# EAGLE schematic Box Electronics v26 (EAGLE 9.7.0)

## Sheet 1 of 3
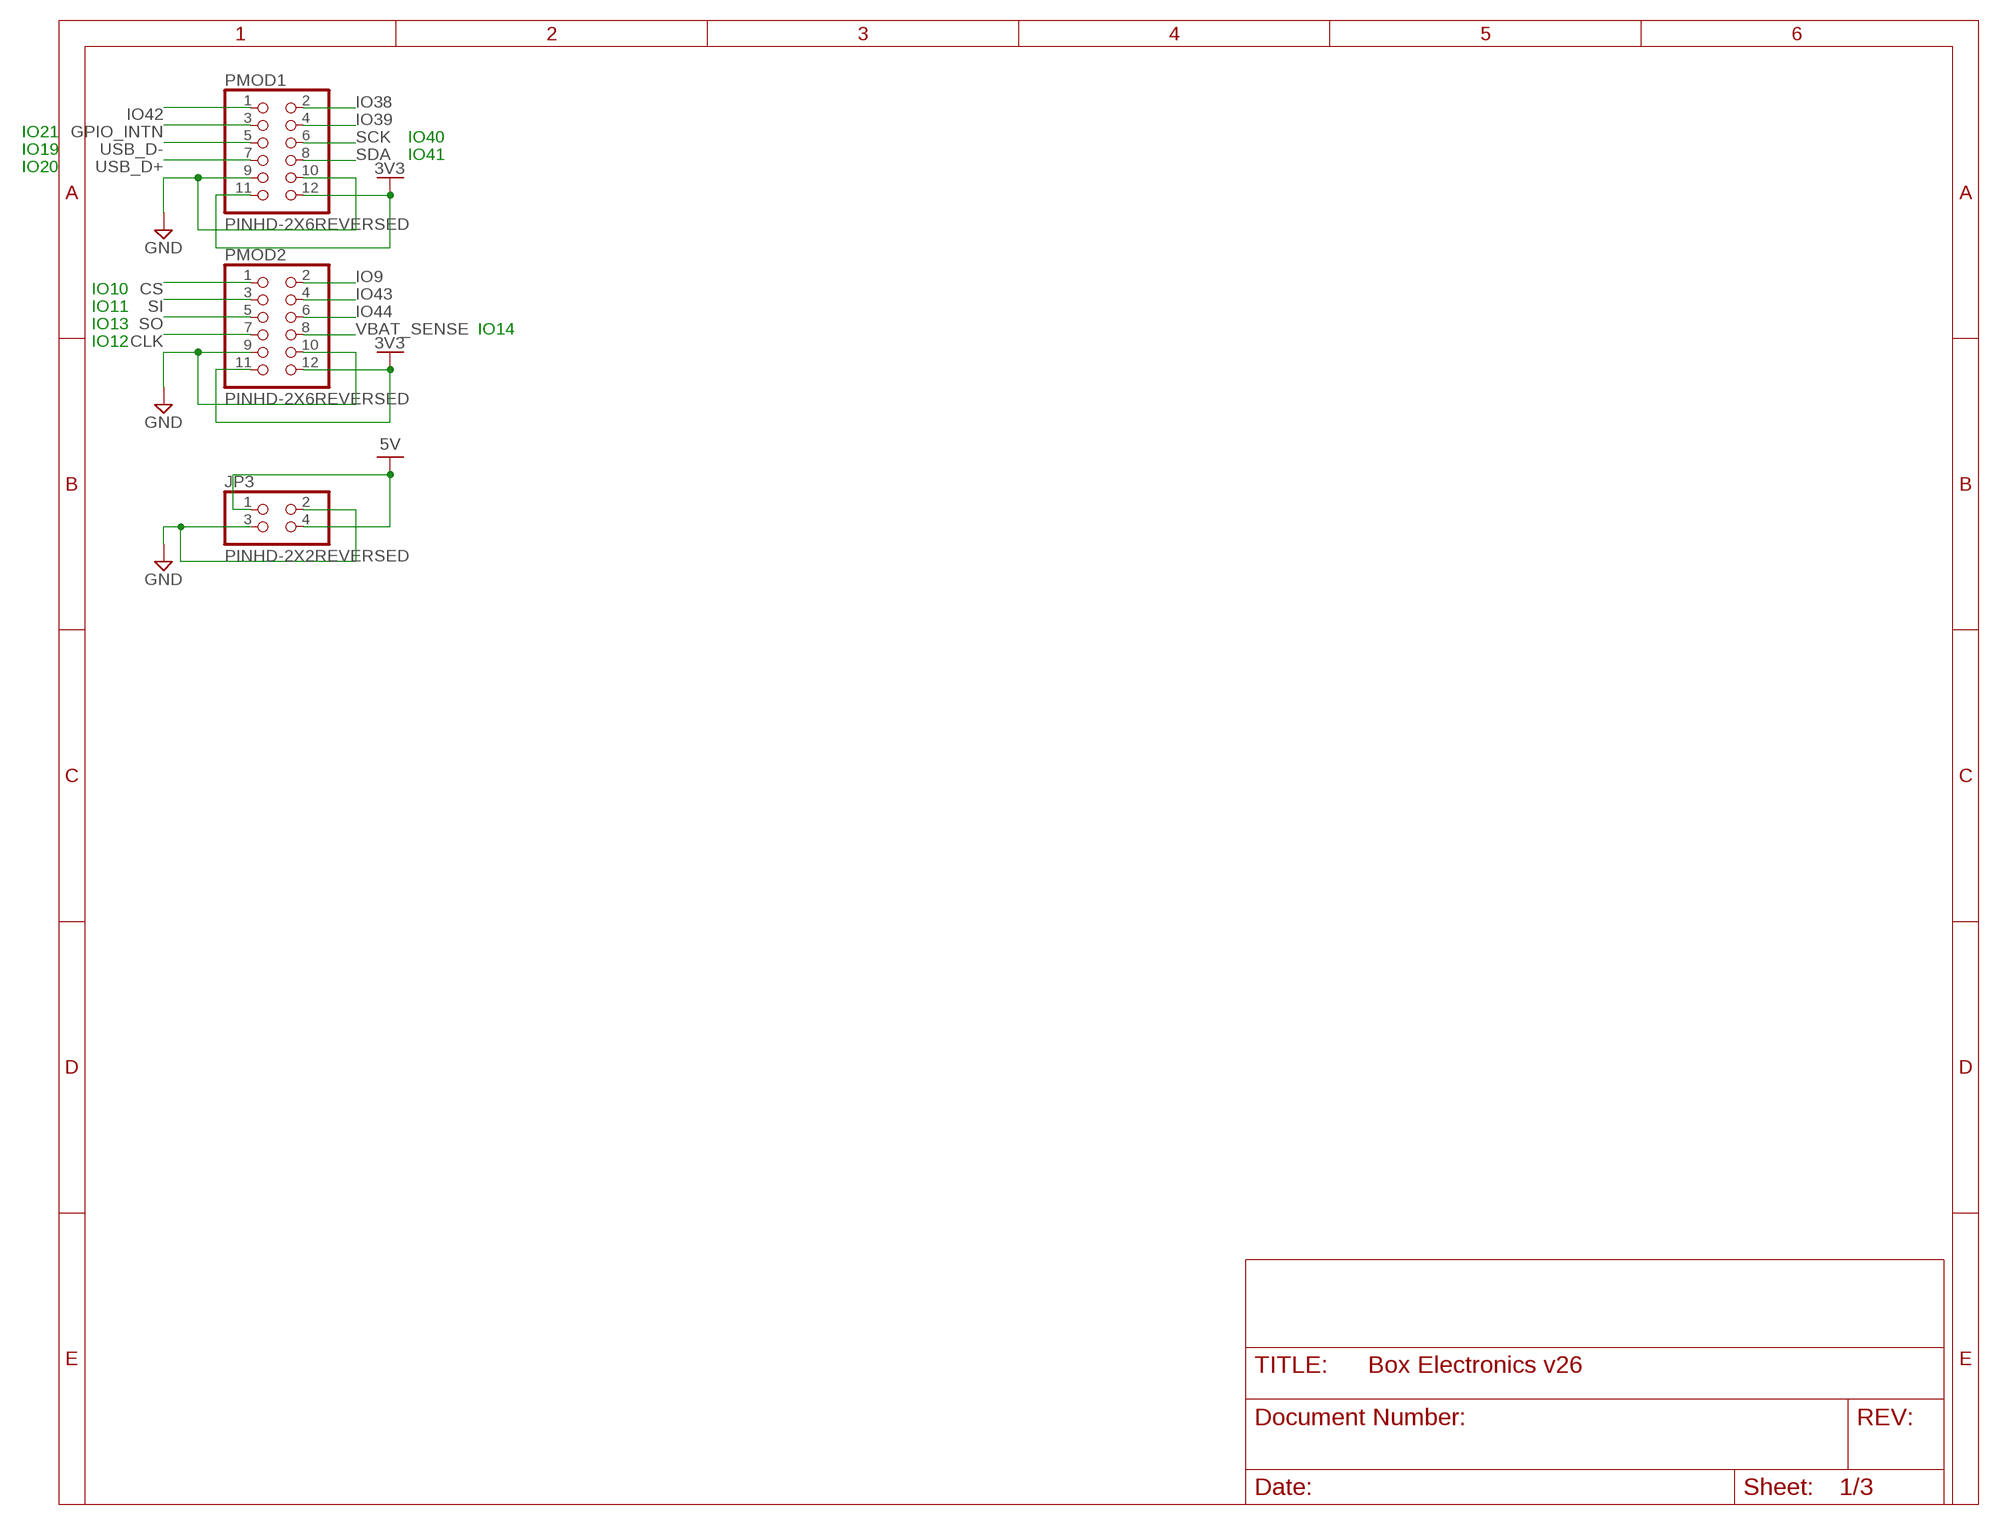
[diagram p0: schematic, sheet 1]

### Parts
JP3  PINHD-2X2REVERSED  [2X02/EDGE_REVERSED]
PMOD1  PINHD-2X6REVERSED  [2X06/EDGE_REVERSED]
PMOD2  PINHD-2X6REVERSED  [2X06/EDGE_REVERSED]

### Nets
3V3: PMOD1.11 PMOD1.12 PMOD2.11 PMOD2.12 ; also sheet 2,3
5V: JP3.1 JP3.4 ; also sheet 2
CLK: PMOD2.7 ; also sheet 2
CS: PMOD2.1 ; also sheet 2
GND: JP3.2 JP3.3 PMOD1.9 PMOD1.10 PMOD2.9 PMOD2.10 ; also sheet 2,3
GPIO_INTN: PMOD1.3 ; also sheet 2
IO9: PMOD2.2
IO38: PMOD1.2
IO39: PMOD1.4
IO42: PMOD1.1
IO43: PMOD2.4
IO44: PMOD2.6
SCK: PMOD1.6 ; also sheet 2
SDA: PMOD1.8 ; also sheet 2
SI: PMOD2.3 ; also sheet 2
SO: PMOD2.5 ; also sheet 2
USB_D+: PMOD1.7 ; also sheet 2
USB_D-: PMOD1.5 ; also sheet 2
VBAT_SENSE: PMOD2.8 ; also sheet 2

### Notes on the sheet
- IO21
- IO19 | IO40
- IO20 | IO41
- IO10
- IO11
- IO13
- IO12 | IO14

## Sheet 2 of 3
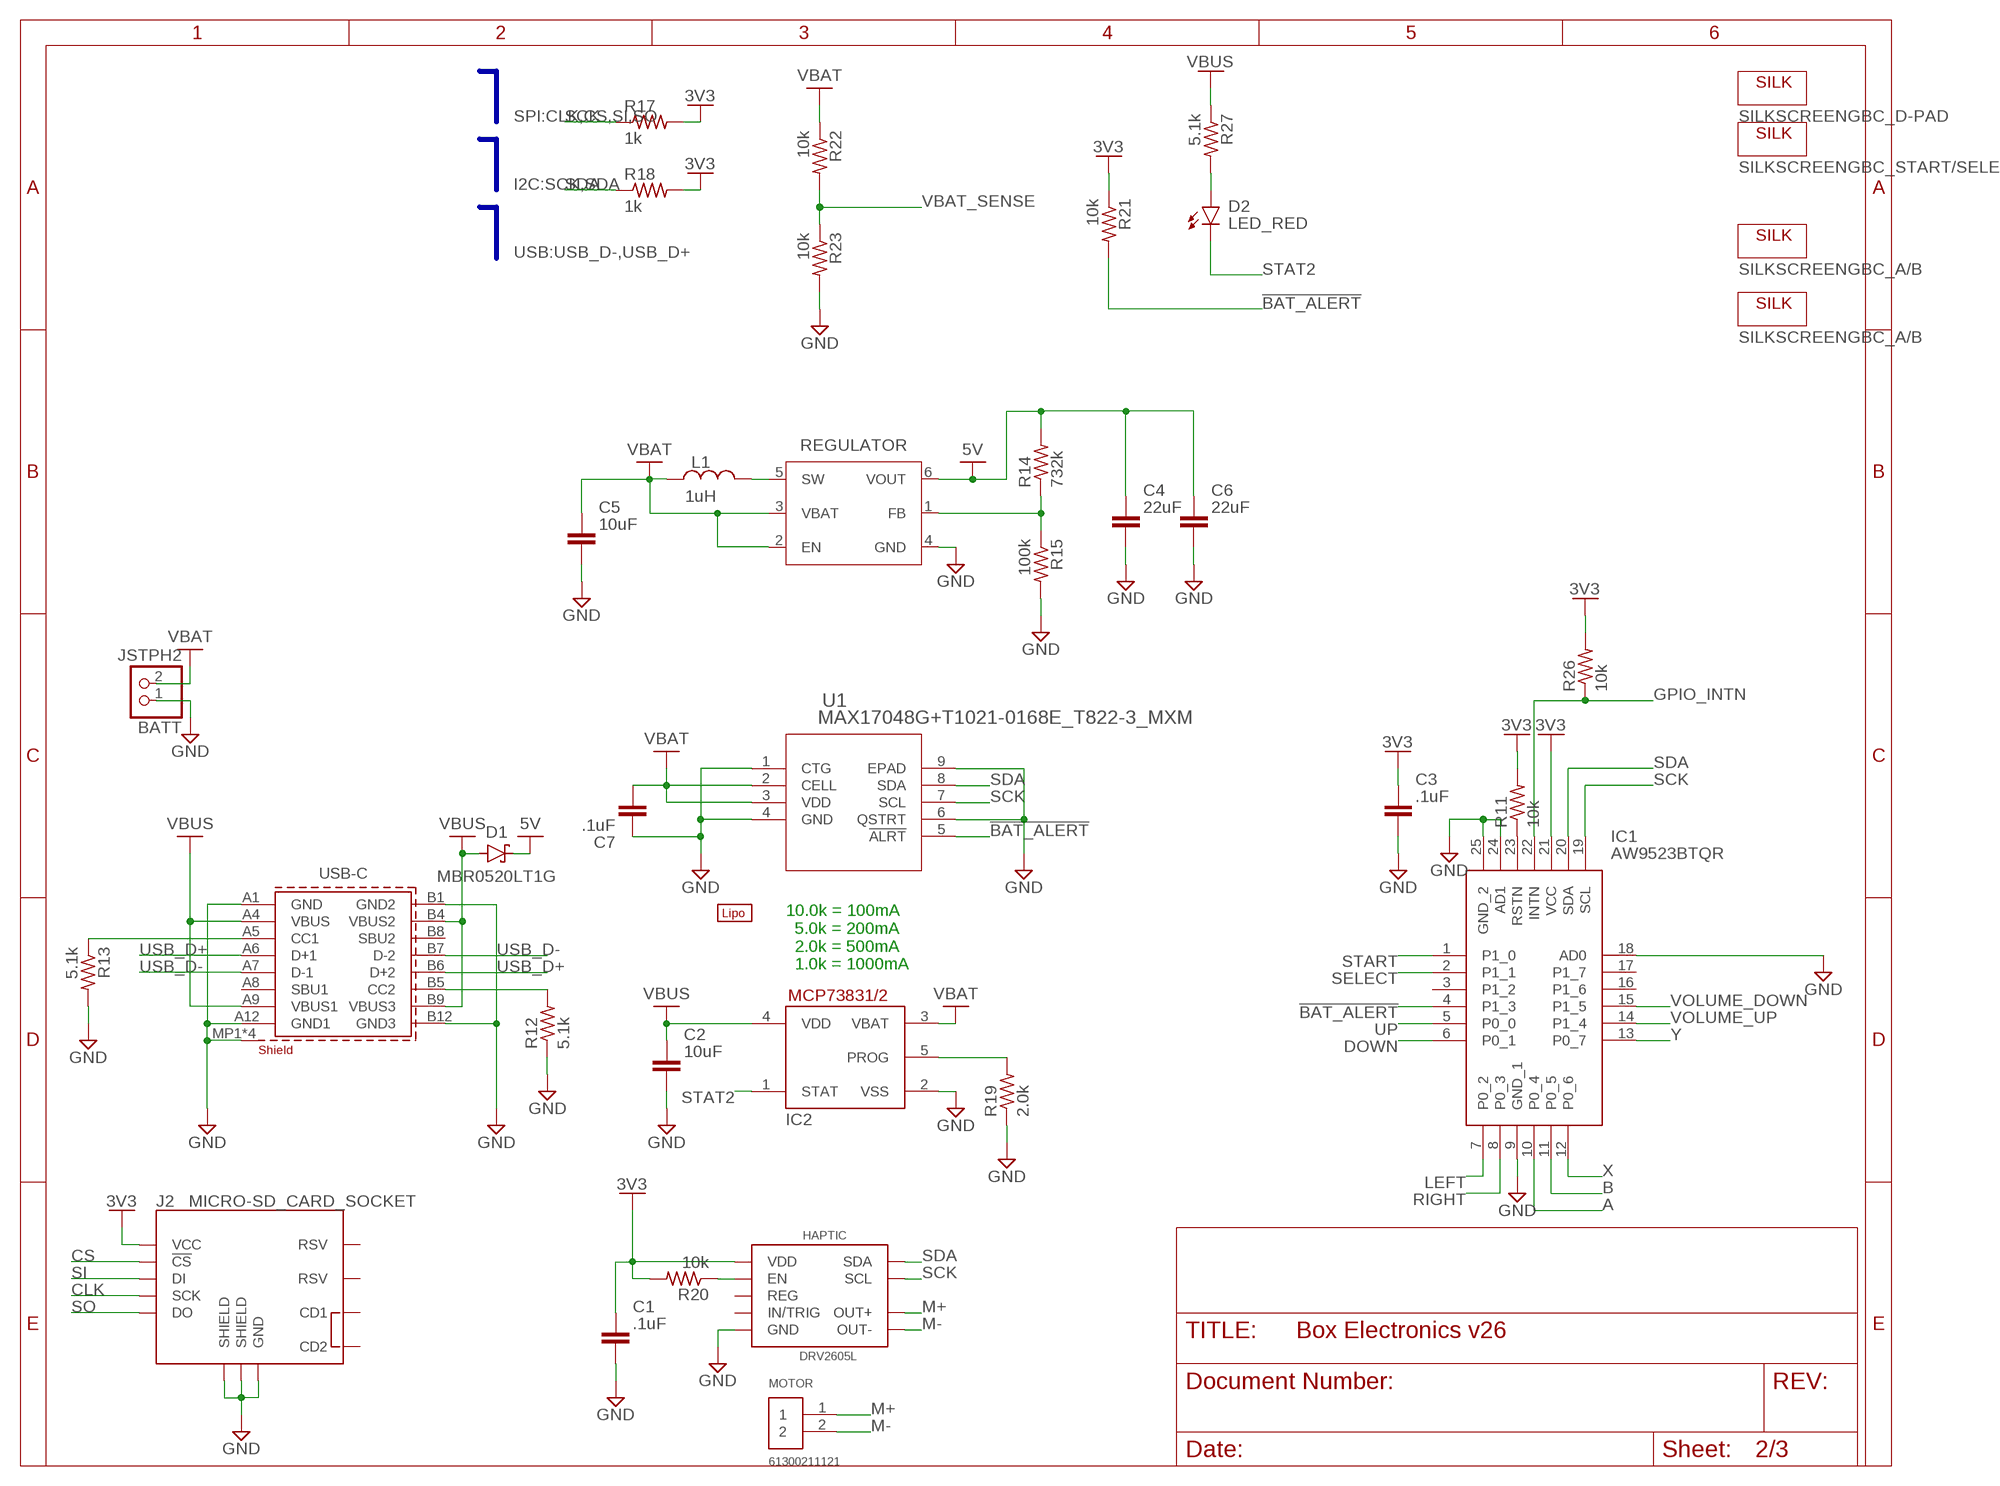
[diagram p1: schematic, sheet 2]

### Parts
BATT  JSTPH2  [JSTPH2]
BT1  LIPO-OUTLINE1100  [LIPO-1000]
C1  .1uF  C_CHIP-0603(1608-METRIC)  [CAPC1608X85]
C2  10uF  C_CHIP-0603(1608-METRIC)  [CAPC1608X85]
C3  .1uF  C_CHIP-0603(1608-METRIC)  [CAPC1608X85]
C4  22uF  C_CHIP-0805(2012-METRIC)  [CAPC2012X110]
C5  10uF  C_CHIP-0603(1608-METRIC)  [CAPC1608X85]
C6  22uF  C_CHIP-0805(2012-METRIC)  [CAPC2012X110]
C7  .1uF  C_CHIP-0603(1608-METRIC)  [CAPC1608X85]
D1  MBR0520LT1G  SCHOTTKY_MBR0520LT1GDO-219  [SODFL3718X115]
D2  LED_RED  CHIP-FLAT-R_0805  [LEDC2012X110N_FLAT-R]
HAPTIC  DRV2605L  [VSSOP-10]
IC1  AW9523BTQR  [QFN50P400X400X80-25N]
IC2  MCP73831/OT  [SOT23-5L]
J2  MICRO-SD_CARD_SOCKET  [MICRO-SD-SOCKET]
L1  1uH  L_CHIP-0805(2012-METRIC)  [INDC2009X120]
MOTOR  61300211121  [61300211121]
R11  10k  R-US_CHIP-0603(1608-METRIC)  [RESC1608X60]
R12  5.1k  R-US_CHIP-0603(1608-METRIC)  [RESC1608X60]
R13  5.1k  R-US_CHIP-0603(1608-METRIC)  [RESC1608X60]
R14  732k  R-US_CHIP-0603(1608-METRIC)  [RESC1608X60]
R15  100k  R-US_CHIP-0603(1608-METRIC)  [RESC1608X60]
R17  1k  R-US_CHIP-0603(1608-METRIC)  [RESC1608X60]
R18  1k  R-US_CHIP-0603(1608-METRIC)  [RESC1608X60]
R19  2.0k  R-US_CHIP-0603(1608-METRIC)  [RESC1608X60]
R20  10k  R-US_CHIP-0603(1608-METRIC)  [RESC1608X60]
R21  10k  R-US_CHIP-0603(1608-METRIC)  [RESC1608X60]
R22  10k  R-US_CHIP-0603(1608-METRIC)  [RESC1608X60]
R23  10k  R-US_CHIP-0603(1608-METRIC)  [RESC1608X60]
R26  10k  R-US_CHIP-0603(1608-METRIC)  [RESC1608X60]
R27  5.1k  R-US_CHIP-0603(1608-METRIC)  [RESC1608X60]
REGULATOR  TPS61070  TPS61023  [SOT563]
U1  MAX17048G+T1021-0168E_T822-3_MXM  [21-0168E_T822-3_MXM]
U$1  SILKSCREENGBC_D-PAD  [GAMEBOY_COLOR_DPAD_SILK]
U$2  SILKSCREENGBC_START/SELECT  [GAMEBOY_COLOR_START_SELECT_SILK]
U$3  SILKSCREENGBC_A/B  [GAMEBOY_COLOR_A/B_BUTTON_MEMBRANE]
U$4  SILKSCREENGBC_A/B  [GAMEBOY_COLOR_A/B_BUTTON_MEMBRANE]
USB-C  629722000214  629722000214SMD  [USB4110GFA]

### Nets
3V3: C1.1 C3.1 HAPTIC.6(VDD) HAPTIC.10(VDD) IC1.21(VCC) J2.VCC R11.2 R17.2 R18.2 R20.2 R21.1 R26.2 ; also sheet 1,3
5V: C4.1 C6.1 D1.1(C) R14.2 REGULATOR.6(VOUT) ; also sheet 1
!BAT_ALERT: IC1.4(P1_3) R21.2 U1.5(!ALRT)
A: IC1.10(P0_4) ; also sheet 3
B: IC1.11(P0_5) ; also sheet 3
CLK: J2.SCLK(SCK) ; also sheet 1
CS: J2.CS(!CS) ; also sheet 1
DOWN: IC1.6(P0_1) ; also sheet 3
GND: BATT.1 C1.2 C2.2 C3.2 C4.2 C5.2 C6.2 C7.1 HAPTIC.8(GND) IC1.9(GND_1) IC1.18(AD0) IC1.24(AD1) IC1.25(GND_2) IC2.2(VSS) J2.GND J2.GND1(SHIELD) J2.GND3(SHIELD) R12.1 R13.2 R15.2 R19.1 R23.2 REGULATOR.4(GND) U1.1(CTG) U1.4(GND) U1.6(QSTRT) U1.9(EPAD) USB-C.A1(GND) USB-C.A12(GND1) USB-C.B1(GND2) USB-C.B12(GND3) USB-C.MP1(SHIELD) USB-C.MP2(SHIELD) USB-C.MP3(SHIELD) USB-C.MP4(SHIELD) ; also sheet 1,3
GPIO_INTN: IC1.22(INTN) R26.1 ; also sheet 1
LEFT: IC1.7(P0_2) ; also sheet 3
M+: HAPTIC.7(OUT+) MOTOR.1
M-: HAPTIC.9(OUT-) MOTOR.2
N$77: R12.2 USB-C.B5(CC2)
N$78: R13.1 USB-C.A5(CC1)
N$79: R14.1 R15.1 REGULATOR.1(FB)
N$80: L1.2 REGULATOR.5(SW)
N$81: IC2.5(PROG) R19.2
N$82: HAPTIC.5(EN) R20.1
N$83: IC1.23(RSTN) R11.1
N$84: D2.A R27.2
RIGHT: IC1.8(P0_3) ; also sheet 3
SCK: HAPTIC.2(SCL) IC1.19(SCL) R17.1 U1.7(SCL) ; also sheet 1
SDA: HAPTIC.3(SDA) IC1.20(SDA) R18.1 U1.8(SDA) ; also sheet 1
SELECT: IC1.2(P1_1) ; also sheet 3
SI: J2.DI ; also sheet 1
SO: J2.DO ; also sheet 1
START: IC1.1(P1_0) ; also sheet 3
STAT2: D2.C IC2.1(STAT)
UP: IC1.5(P0_0) ; also sheet 3
USB_D+: USB-C.A6(D+1) USB-C.B6(D+2) ; also sheet 1
USB_D-: USB-C.A7(D-1) USB-C.B7(D-2) ; also sheet 1
VBAT: BATT.2 C5.1 C7.2 IC2.3(VBAT) L1.1 R22.1 REGULATOR.2(EN) REGULATOR.3(VBAT) U1.2(CELL) U1.3(VDD)
VBAT_SENSE: R22.2 R23.1 ; also sheet 1
VBUS: C2.1 D1.2(A) IC2.4(VDD) R27.1 USB-C.A4(VBUS) USB-C.A9(VBUS1) USB-C.B4(VBUS2) USB-C.B9(VBUS3)
VOLUME_DOWN: IC1.15(P1_5) ; also sheet 3
VOLUME_UP: IC1.14(P1_4) ; also sheet 3
X: IC1.12(P0_6) ; also sheet 3
Y: IC1.13(P0_7) ; also sheet 3
Unconnected: HAPTIC.1(REG) HAPTIC.4(IN/TRIG) IC1.3(P1_2) IC1.16(P1_6) IC1.17(P1_7) J2.CD1 J2.CD2 J2.RSV1(RSV) J2.RSV2(RSV) USB-C.A8(SBU1) USB-C.B8(SBU2)

### Buses
SPI:CLK,CS,SI,SO
I2C:SCK,SDA
USB:USB_D-,USB_D+

### Notes on the sheet
- 10.0k = 100mA
    5.0k = 200mA
    2.0k = 500mA
    1.0k = 1000mA

## Sheet 3 of 3
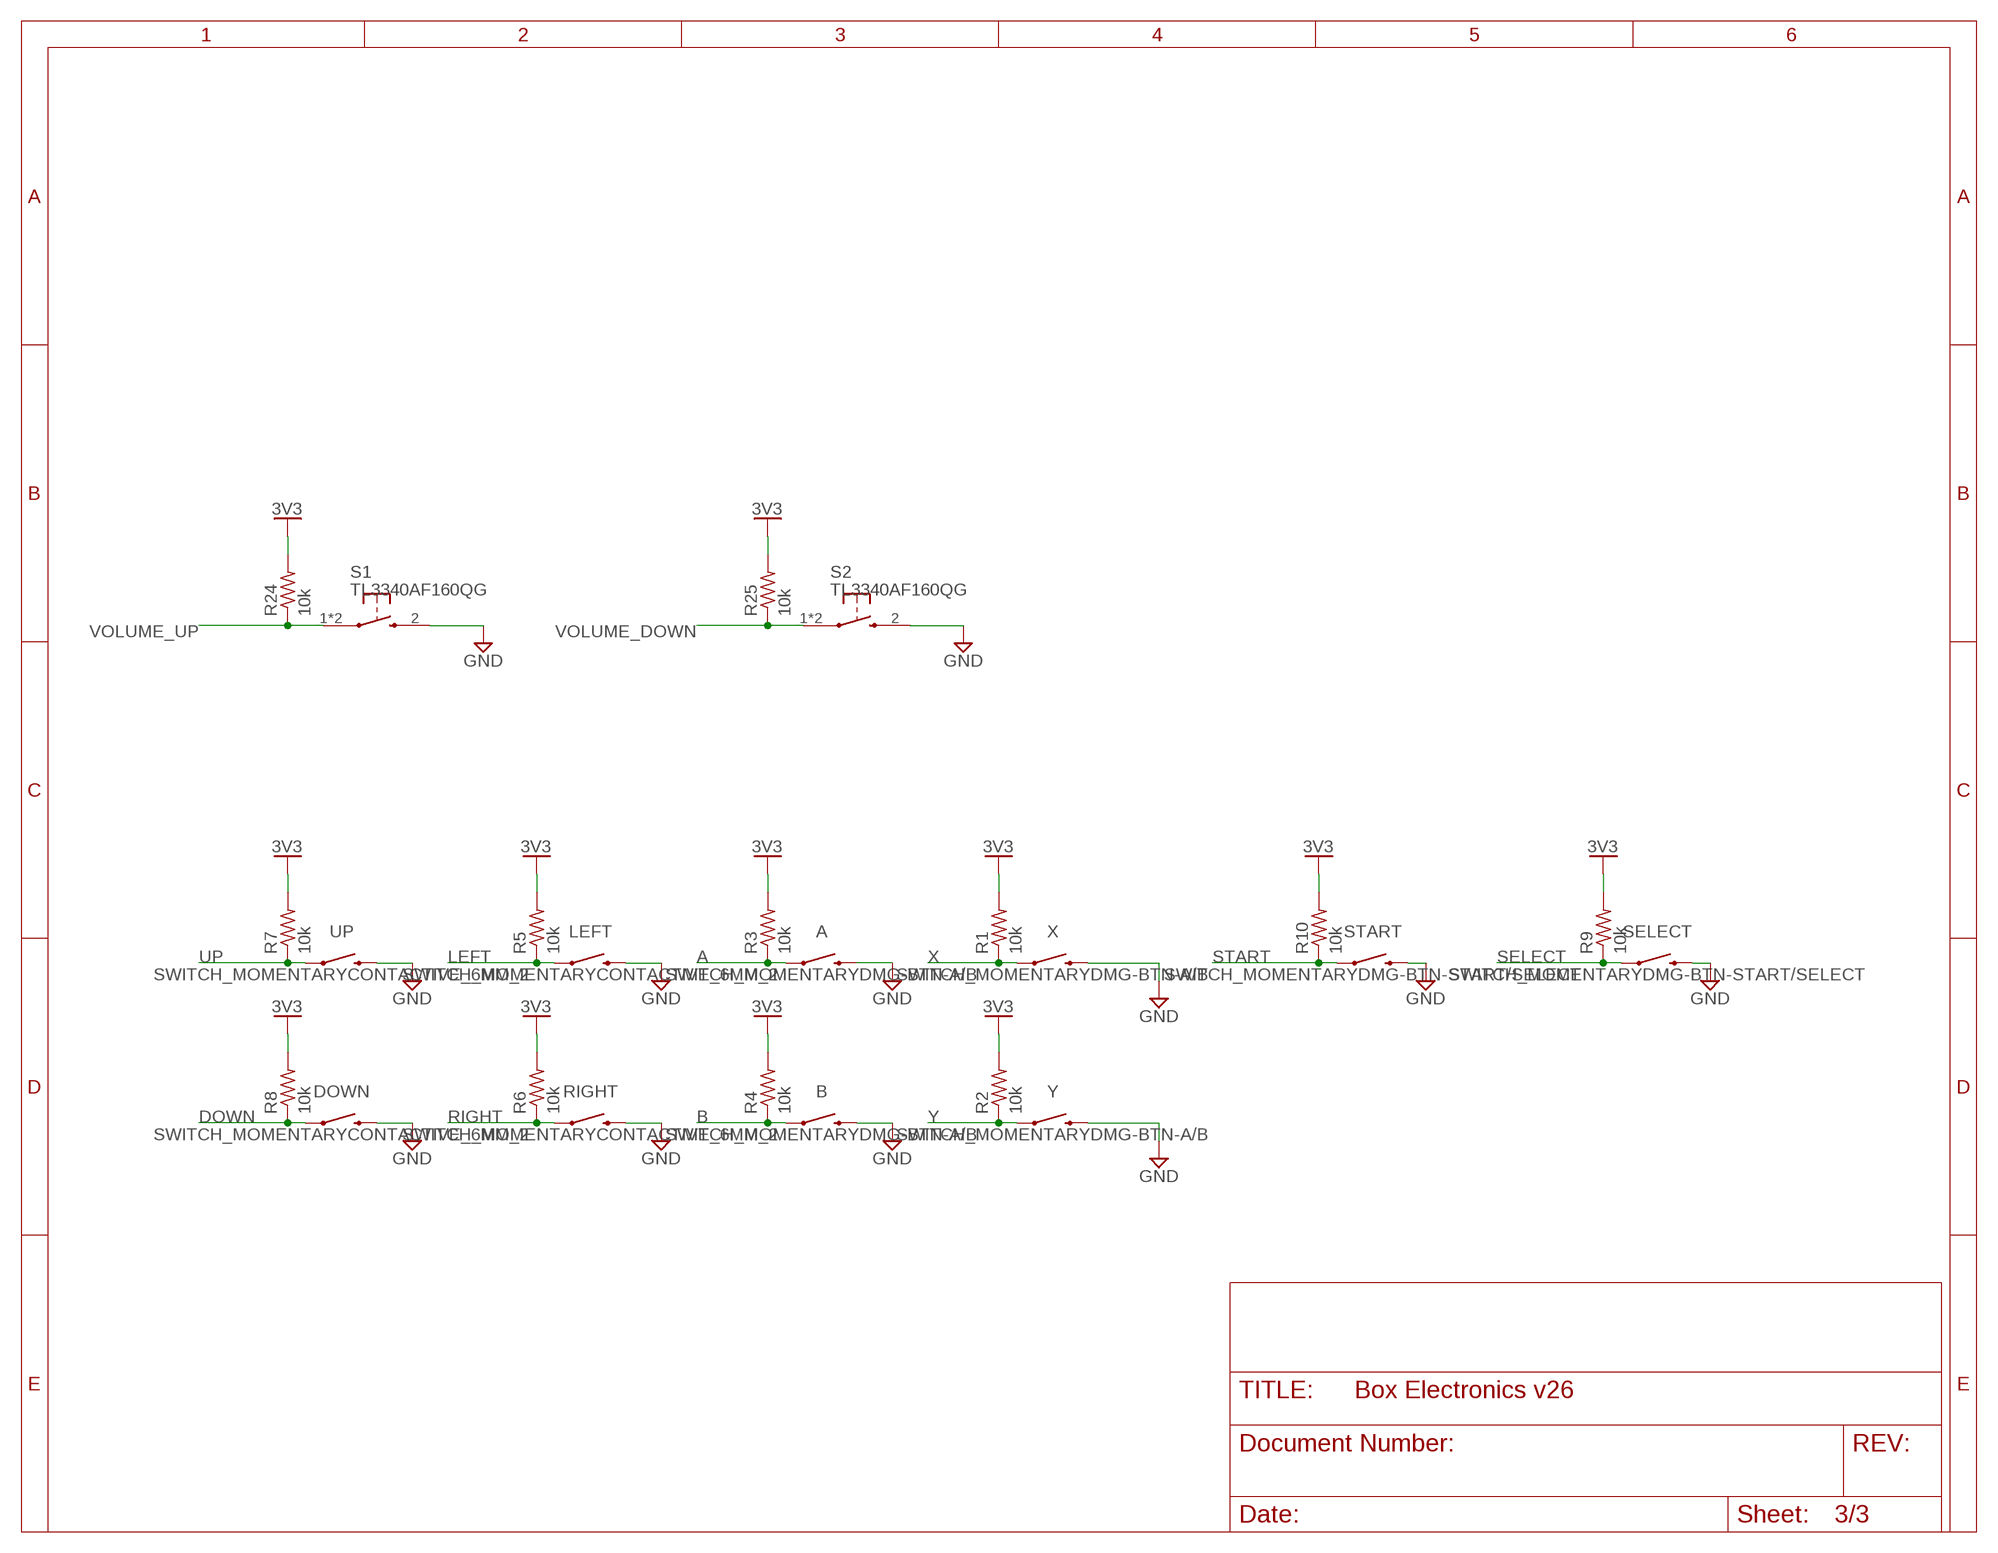
[diagram p2: schematic, sheet 3]

### Parts
A  SWITCH_MOMENTARYDMG-BTN-A/B  [DMG_BTN3]
B  SWITCH_MOMENTARYDMG-BTN-A/B  [DMG_BTN3]
DOWN  SWITCH_MOMENTARYCONTACTIVE_6MM_2  [BUTTON-CONDUCTIVE_6MM_2]
LEFT  SWITCH_MOMENTARYCONTACTIVE_6MM_2  [BUTTON-CONDUCTIVE_6MM_2]
R1  10k  R-US_CHIP-0603(1608-METRIC)  [RESC1608X60]
R2  10k  R-US_CHIP-0603(1608-METRIC)  [RESC1608X60]
R3  10k  R-US_CHIP-0603(1608-METRIC)  [RESC1608X60]
R4  10k  R-US_CHIP-0603(1608-METRIC)  [RESC1608X60]
R5  10k  R-US_CHIP-0603(1608-METRIC)  [RESC1608X60]
R6  10k  R-US_CHIP-0603(1608-METRIC)  [RESC1608X60]
R7  10k  R-US_CHIP-0603(1608-METRIC)  [RESC1608X60]
R8  10k  R-US_CHIP-0603(1608-METRIC)  [RESC1608X60]
R9  10k  R-US_CHIP-0603(1608-METRIC)  [RESC1608X60]
R10  10k  R-US_CHIP-0603(1608-METRIC)  [RESC1608X60]
R24  10k  R-US_CHIP-0603(1608-METRIC)  [RESC1608X60]
R25  10k  R-US_CHIP-0603(1608-METRIC)  [RESC1608X60]
RIGHT  SWITCH_MOMENTARYCONTACTIVE_6MM_2  [BUTTON-CONDUCTIVE_6MM_2]
S1  TL3340AF160QG  [TL3340]
S2  TL3340AF160QG  [TL3340]
SELECT  SWITCH_MOMENTARYDMG-BTN-START/SELECT  [DMG_BTN1_W2]
START  SWITCH_MOMENTARYDMG-BTN-START/SELECT  [DMG_BTN1_W2]
UP  SWITCH_MOMENTARYCONTACTIVE_6MM_2  [BUTTON-CONDUCTIVE_6MM_2]
X  SWITCH_MOMENTARYDMG-BTN-A/B  [DMG_BTN3]
Y  SWITCH_MOMENTARYDMG-BTN-A/B  [DMG_BTN3]

### Nets
3V3: R1.2 R2.2 R3.2 R4.2 R5.2 R6.2 R7.2 R8.2 R9.2 R10.2 R24.2 R25.2 ; also sheet 1,2
A: A.P$1 A.P$3 R3.1 ; also sheet 2
B: B.P$1 B.P$3 R4.1 ; also sheet 2
DOWN: DOWN.1 R8.1 ; also sheet 2
GND: A.P$2 A.P$4 B.P$2 B.P$4 DOWN.2 LEFT.2 RIGHT.2 S1.2 S2.2 SELECT.P$2 SELECT.P$4 START.P$2 START.P$4 UP.2 X.P$2 X.P$4 Y.P$2 Y.P$4 ; also sheet 1,2
LEFT: LEFT.1 R5.1 ; also sheet 2
RIGHT: R6.1 RIGHT.1 ; also sheet 2
SELECT: R9.1 SELECT.P$1 SELECT.P$3 ; also sheet 2
START: R10.1 START.P$1 START.P$3 ; also sheet 2
UP: R7.1 UP.1 ; also sheet 2
VOLUME_DOWN: R25.1 S2.1 S2.3 ; also sheet 2
VOLUME_UP: R24.1 S1.1 S1.3 ; also sheet 2
X: R1.1 X.P$1 X.P$3 ; also sheet 2
Y: R2.1 Y.P$1 Y.P$3 ; also sheet 2

## Library data of the parts
A B DOWN LEFT RIGHT SELECT START UP X Y = Inputs:SWITCH_MOMENTARY
BATT = Tutorial - Fusion 360:JSTPH2
BT1 = SparkFun-Batteries:LIPO-OUTLINE: LiPo Battery Outlines Outlines for common LiPo batteries sold by SparkFun. (Note: no terminals or connection points, just the dimensions.) SparkFun Products Polymer Lithium Ion Battery - 110mAh <https://www.sparkfun.com/products/13853> (PRT-13853) Polymer Lithium Ion Battery - 1000mAh <https://www.sparkfun.com/products/13813> (PRT-13813) Polymer Lithium Ion Battery - 2000mAh <https://www.sparkfun.com/products/8483> (PRT-08483); PROD_ID: BATT-13243; SF_SKU: PRT-13813
C1-C3 C5 C7 = Capacitor:C: Capacitor - Generic; CATEGORY: Capacitor
C4 C6 = Capacitor:C: Capacitor - Generic; CATEGORY: Capacitor; MOUSER: https://www.mouser.com/ProductDetail/Samsung-Electro-Mechanics/CL21A226MQQNNNF?qs=sGAEpiMZZMs7ZEmUmaUL0wnmEc5iLKHP2isAklsGkAs%3D
D1 = Diode:SCHOTTKY_: Schottky Diode - Popular parts; CATEGORY: Diode; DESCRIPTION: DIODE SCHOTTKY 20V 500MA SOD123; MANUFACTURER: ON Semiconductor; MPN: MBR0520LT1G; SUB-CATEGORY: Schottky
D2 = LED:CHIP-FLAT-R; CATEGORY: LED; COLOR: RED; DESCRIPTION: CHIP LED FLAT; MANUFACTURER: Wurth Electronik; MOUSER: https://www.mouser.com/ProductDetail/Wurth-Elektronik/150080RS75000?qs=LlUlMxKIyB2jdCo7bnfgew%3D%3D; MPN: 150080RS75000; SUB-CATEGORY: CHIP; TYPE: FLAT_TOP
HAPTIC = SparkFun-IC-Special-Function:DRV2605L; PROD_ID: IC-13504
IC1 = ICs:AW9523BTQR: 16 MULTI-FUNCTION LED DRIVER AND GPIO CONTROLLER WITH I2C INTERFACE Source: Datasheet <https://www.alldatasheet.net/datasheet-pdf/pdf/1148543/AWINIC/AW9523BTQR.html>; DESCRIPTION: 16 MULTI-FUNCTION LED DRIVER AND GPIO CONTROLLER WITH I2C INTERFACE; HEIGHT: 0.8mm; MANUFACTURER_NAME: AWINIC; MANUFACTURER_PART_NUMBER: AW9523BTQR
IC2 = ICs:MCP73831: MCP73831/2 Miniature Single-Cell, Fully Integrated Li-Ion, Li-Polymer Charge Management Controllers. Nice and small simple lipoly charge controller, with adjustable current and status output (LED) http://www.ladyada.net/library/pcb/eaglelibrary.html
J2 = SparkFun-Connectors:MICRO-SD_CARD_SOCKET: microSD Socket for Transflash Push-push type µSD socket. tDoc lines correctly indicate media card edge positions when inserting (unlocked, locked, depressed). NOTE: CD1 and CD2 are connected internally, and the default detect state of the socket is detect pin to ground. SparkFun Products: WAV Trigger <https://www.sparkfun.com/products/13660> CAN-Bus Shield <https://www.sparkfun.com/products/13262> SparkFun Level Shifing microSD Breakout <https://www.sparkfun.com/products/13743>; PROD_ID: CONN-07820; SF_ID: PRT-00127
JP3 = My Connectors:PINHD-2X2: PIN HEADER; MOUSER: https://www.mouser.com/ProductDetail/Amphenol-FCI/10129383-904001BLF?qs=0lQeLiL1qyZnX0KFA9qZpw%3D%3D
L1 = Inductor:L: Inductor Fixed - Generic; CATEGORY: Inductor; MOUSER: https://www.mouser.com/ProductDetail/TDK/MLZ2012A1R0WT000?qs=%2FPzWLGNeQ%252BjNsoWh9l1QhQ%3D%3D; SUB-CATEGORY: Fixed
MOTOR = Headers:61300211121: CONN HEADER VERT 2POS 2.54MM Manufacturer's datasheet <https://katalog.we-online.de/em/datasheet/6130xx11121.pdf>; CREATED_BY: PCBLayout.com; DIGI_KEY_PART_NUMBER: 732-5315-ND; MANUFACTURER: Wurth Electronics Inc.; MPN: 61300211121
PMOD1 PMOD2 = My Connectors:PINHD-2X6: PIN HEADER
R1-R15 R17-R27 = Tutorial - Fusion 360:R-US: Resistor Fixed - ANSI; CATEGORY: Resistor; SUB-CATEGORY: Fixed
REGULATOR = Library:TPS61023: Synchronous Boost Converter With 600-mA Switch Datasheet <https://www.ti.com/lit/ds/symlink/tps61070.pdf?ts=1593507986589&ref_url=https%253A%252F%252Fwww.ti.com%252Fstore%252Fti%252Fen%252Fp%252Fproduct%252F%253Fp%253DTPS61070DDCR>
S1 S2 = Library:TL3340AF160QG: E-SWITCH - TL3340AF160QG. - SWITCH, TACTILE SPST 50mA, SMD GULL WING Source: Datasheet <https://datasheet.datasheetarchive.com/originals/distributors/SFDatasheet-1/sf-00021244.pdf>; DESCRIPTION: E-SWITCH - TL3340AF160QG. - SWITCH, TACTILE SPST 50mA, SMD GULL WING; HEIGHT: mm; MANUFACTURER_NAME: E-Switch; MANUFACTURER_PART_NUMBER: TL3340AF160QG; MOUSER_PART_NUMBER: 612-TL3340AF160QG; MOUSER_PRICE-STOCK: https://www.mouser.co.uk/ProductDetail/E-Switch/TL3340AF160QG?qs=Cv1v43EOJpo402rrfE5MlQ%3D%3D
U1 = ICs:MAX17048G+T10; COPYRIGHT: Copyright (C) 2023 Ultra Librarian. All rights reserved.; MANUFACTURER_PART_NUMBER: MAX17048G+T10; MFR_NAME: Analog Devices / Maxim Integrated
U$1-U$4 = Inputs:SILKSCREEN
USB-C = Wurth_Connectors_WR-USB:629722000214: WR-COM USB 2.0 Type C Plug Vertical SMT Kind Properties Durability 10 000 Mating cycles Gender Receptacle Type Horizontal General Information Operating Temperature -40 up to +85 °C Electrical Properties Working Voltage 20 V (DC) Withstanding Voltage 100 V (AC) Contact Resistance 40 mΩ Material Properties Insulator Material LCP Insulator Flammability Rating UL94 V-0 Insulator Color Black Contact Material Brass Contact Plating Gold over Nickel Contact Type Stamped Shielding Material Steel Shielding Plating Nickel (Ni) <https://www.we-online.com/catalog/media/o689297v209%20family-wr-com-629722000214.jpg> Details see: www.we-online.com/catalog/WR-COM_USB_20_TYPE_C_RECEPTACLE_HORIZONTAL_SMT <www.we-online.com/catalog/WR-COM_USB_20_TYPE_C_RECEPTACLE_HORIZONTAL_SMT/?utm_source=eagle_model&utm_medium=description_link&utm_campaign=eisos_eagle> Updated by Ella Wu 2022-11-15 2022 (C) Würth Elektronik